# EAGLE design clock (EAGLE 7.6.0)
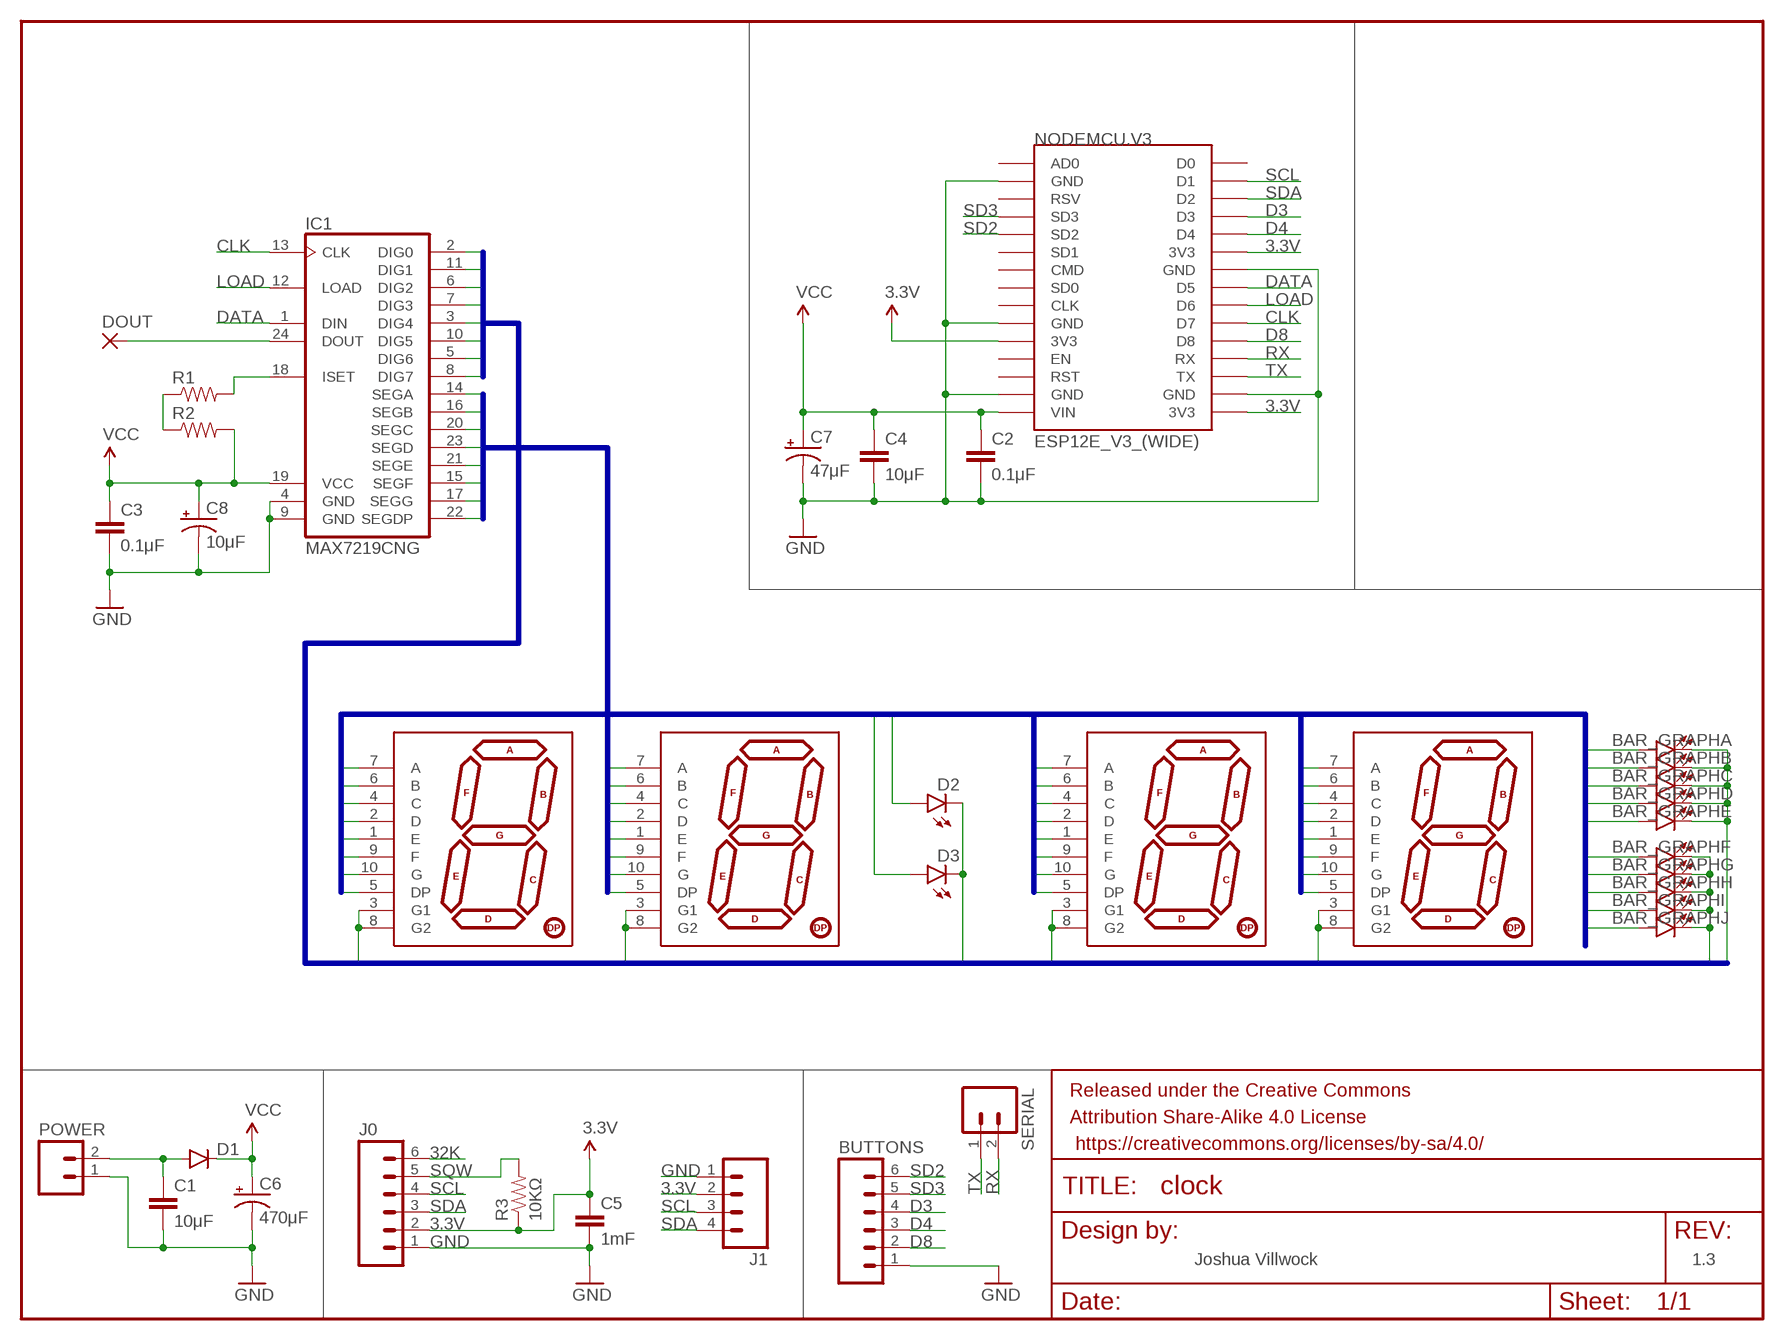
[diagram p0: schematic, sheet 1]

## Parts
BAR_GRAPH  LED_BARGRAPH_10  [LED_BARGAPH_10]
BUTTONS  M06POLAR  [MOLEX-1X6]
C1  10μF  CAP1206  [1206]
C2  0.1μF  CAP1206  [1206]
C3  0.1μF  CAP1206  [1206]
C4  10μF  CAP1206  [1206]
C5  1mF  CAP1206  [1206]
C6  470μF  CAP_POLPTH1  [CPOL-RADIAL-100UF-25V]
C7  47μF  CAP_POLPTH1  [CPOL-RADIAL-100UF-25V]
C8  10μF  CAP_POLPTH1  [CPOL-RADIAL-100UF-25V]
D1  DIODE1N4148  [DIODE-1N4148]
D2  LED3MM  [LED3MM]
D3  LED3MM  [LED3MM]
DIG_0  7-SEGMENT-DISPLAY-REAL-1"  [7-SEGMENT-REAL-1"]
DIG_1  7-SEGMENT-DISPLAY-REAL-1"  [7-SEGMENT-REAL-1"]
DIG_2  7-SEGMENT-DISPLAY-REAL-1"  [7-SEGMENT-REAL-1"]
DIG_3  7-SEGMENT-DISPLAY-REAL-1"  [7-SEGMENT-REAL-1"]
DOUT  1,6/0,9  [1,6/0,9]
FRAME1  FRAME-LETTER  [CREATIVE_COMMONS]
IC1  MAX7219CNG  [DIL24-3]
J0  M06POLAR  [MOLEX-1X6]
J1  M04POLAR  [MOLEX-1X4]
NODEMCU.V3  ESP12E_V3_(WIDE)  [ESP12E_V3_WIDE]
POWER  M02POLAR_LOCK  [MOLEX-1X2_LOCK]
R1  RESISTOR1206  [1206]
R2  RESISTOR1206  [1206]
R3  10KΩ  RESISTOR1206  [1206]
SERIAL  M02PTH  [1X02]

## Nets
3.3V: C5.1 J0.2 J1.2 NODEMCU.V3.3V3@0(3V3) NODEMCU.V3.3V3@1(3V3) NODEMCU.V3.3V3@2(3V3) R3.1
32K: J0.6
A: BAR_GRAPH.4(D:A) BAR_GRAPH.9(I:A) DIG_0.7(A) DIG_1.7(A) DIG_2.7(A) DIG_3.7(A) IC1.14(SEGA)
B: BAR_GRAPH.3(C:A) BAR_GRAPH.8(H:A) DIG_0.6(B) DIG_1.6(B) DIG_2.6(B) DIG_3.6(B) IC1.16(SEGB)
C: BAR_GRAPH.2(B:A) BAR_GRAPH.7(G:A) DIG_0.4(C) DIG_1.4(C) DIG_2.4(C) DIG_3.4(C) IC1.20(SEGC)
CLK: IC1.13(CLK) NODEMCU.V3.D7
D: BAR_GRAPH.1(A:A) BAR_GRAPH.6(F:A) D3.A DIG_0.2(D) DIG_1.2(D) DIG_2.2(D) DIG_3.2(D) IC1.23(SEGD)
D3: BUTTONS.4 NODEMCU.V3.D3
D4: BUTTONS.3 NODEMCU.V3.D4
D8: BUTTONS.2 NODEMCU.V3.D8
DATA: IC1.1(DIN) NODEMCU.V3.D5
DIGIT0: DIG_1.3(G1) DIG_1.8(G2) IC1.2(DIG0)
DIGIT1: DIG_2.3(G1) DIG_2.8(G2) IC1.11(DIG1)
DIGIT2: IC1.6(DIG2)
DIGIT3: BAR_GRAPH.16(E:C) BAR_GRAPH.17(D:C) BAR_GRAPH.18(C:C) BAR_GRAPH.19(B:C) BAR_GRAPH.20(A:C) IC1.7(DIG3)
DIGIT4: D2.K(C) D3.K(C) IC1.3(DIG4)
DIGIT5: DIG_3.3(G1) DIG_3.8(G2) IC1.10(DIG5)
DIGIT6: DIG_0.3(G1) DIG_0.8(G2) IC1.5(DIG6)
DIGIT7: BAR_GRAPH.11(J:C) BAR_GRAPH.12(I:C) BAR_GRAPH.13(H:C) BAR_GRAPH.14(G:C) BAR_GRAPH.15(F:C) IC1.8(DIG7)
DOUT: DOUT.1(P) IC1.24(DOUT)
DP: BAR_GRAPH.5(E:A) BAR_GRAPH.10(J:A) DIG_0.5(DP) DIG_1.5(DP) DIG_2.5(DP) DIG_3.5(DP) IC1.22(SEGDP)
E: DIG_0.1(E) DIG_1.1(E) DIG_2.1(E) DIG_3.1(E) IC1.21(SEGE)
F: D2.A DIG_0.9(F) DIG_1.9(F) DIG_2.9(F) DIG_3.9(F) IC1.15(SEGF)
G: DIG_0.10(G) DIG_1.10(G) DIG_2.10(G) DIG_3.10(G) IC1.17(SEGG)
GND: BUTTONS.1 C1.2 C2.2 C3.2 C4.2 C5.2 C6.2(-) C7.2(-) C8.2(-) IC1.4(GND) IC1.9(GND) J0.1 J1.1 NODEMCU.V3.GND@0(GND) NODEMCU.V3.GND@1(GND) NODEMCU.V3.GND@2(GND) NODEMCU.V3.GND@3(GND) NODEMCU.V3.GND@5(GND) POWER.1
ISET: IC1.18(ISET) R1.2
LOAD: IC1.12(LOAD) NODEMCU.V3.D6
N$4: R1.1 R2.1
RX: NODEMCU.V3.RX SERIAL.2
SCL: J0.4 J1.3 NODEMCU.V3.D1
SD2: BUTTONS.6 NODEMCU.V3.SD2
SD3: BUTTONS.5 NODEMCU.V3.SD3
SDA: J0.3 J1.4 NODEMCU.V3.D2
SQW: J0.5 R3.2
TX: NODEMCU.V3.TX SERIAL.1
VCC: C2.1 C3.1 C4.1 C6.1(+) C7.1(+) C8.1(+) D1.C IC1.19(VCC) NODEMCU.V3.VIN R2.2
VIN: C1.1 D1.A POWER.2
Unconnected: NODEMCU.V3.AD0 NODEMCU.V3.CLK NODEMCU.V3.CMD NODEMCU.V3.D0 NODEMCU.V3.EN NODEMCU.V3.RST NODEMCU.V3.RSV@1(RSV) NODEMCU.V3.SD0 NODEMCU.V3.SD1

## Buses
DIGIT[0..7]
SEG:A,B,C,D,E,F,G,DP

## Notes on the sheet
- Joshua Villwock | 1.3

## Library data of the parts
BAR_GRAPH = SparkFun-LED:LED_BARGRAPH_10: 10-Segment LED Bar Graph SFE part numbers: COM-09935 (red, Vf = 2.1V, Ifmax = 20mA) COM-09936 (yellow, Vf = 2.1V, Ifmax = 20mA) COM-09937 (blue, Vf = 3.4V, Ifmax = 20mA) COM-09938 (green, Vf = 3.4V, Ifmax = 20mA)
BUTTONS J0 = SparkFun-Connectors:M06: Header 6 Standard 6-pin 0.1" header. Use with straight break away headers (SKU : PRT-00116), right angle break away headers (PRT-00553), swiss pins (PRT-00743), machine pins (PRT-00117), and female headers (PRT-00115). Molex polarized connector foot print use with SKU : PRT-08094 with associated crimp pins and housings. NOTES ON THE VARIANTS LOCK and LOCK_LONGPADS... This footprint was designed to help hold the alignment of a through-hole component (i.e. 6-pin header) while soldering it into place. You may notice that each hole has been shifted either up or down by 0.005 of an inch from it's more standard position (which is a perfectly straight line). This slight alteration caused the pins (the squares in the middle) to touch the edges of the holes. Because they are alternating, it causes a "brace" to hold the component in place. 0.005 has proven to be the perfect amount of "off-center" position when using our standard breakaway headers. Although looks a little odd when you look at the bare footprint, once you have a header in there, the alteration is very hard to notice. Also,if you push a header all the way into place, it is covered up entirely on the bottom side. This idea of altering the position of holes to aid alignment will be further integrated into the Sparkfun Library for other footprints. It can help hold any component with 3 or more connection pins.
C1-C5 = SparkFun-Capacitors:CAP: Capacitor Standard 0603 ceramic capacitor, and 0.1" leaded capacitor.
C6-C8 = SparkFun-Capacitors:CAP_POL: Capacitor Polarized These are standard SMD and PTH capacitors. Normally 10uF, 47uF, and 100uF in electrolytic and tantalum varieties. Always verify the external diameter of the through hole cap, it varies with capacity, voltage, and manufacturer. The EIA devices should be standard.
D1 = SparkFun-DiscreteSemi:DIODE: Diode These are standard reverse protection diodes and small signal diodes. SMA package can handle up to about 1A. SOD-323 can handle about 200mA. What the SOD-323 package when ordering, there are some mfgs out there that are 5-pin packages.; PROD_ID: DIO-08378; VALUE: 1N4148
D2 D3 = SparkFun-LED:LED: LEDs Standard schematic elements and footprints for 5mm, 3mm, 1206, and 0603 sized LEDs. 5mm - Spark Fun Electronics SKU : COM-00529 (and others); PROD_ID: DIO-08794
DIG_0 DIG_1-DIG_3 = custom_display:7-SEGMENT-DISPLAY-REAL-1": 7-Segment Display 1" Red (COM-08546) EZ is for kits. Pads are only exposed on the bottom side to help prevent soldering in upside down.
DOUT = wirepad:1,6/0,9: THROUGH-HOLE PAD
FRAME1 = SparkFun-Aesthetics:FRAME-LETTER: Schematic Frame Standard 8.5x11 US Letter frame
IC1 = max7219:MAX7219CNG: LED DISPLAY DRIVER; MF: MAXIM; MPN: MAX7219CNG; OC_FARNELL: 1523914; OC_NEWARK: 34C4018
J1 = SparkFun-Connectors:M04: Header 4 Standard 4-pin 0.1" header. Use with straight break away headers (SKU : PRT-00116), right angle break away headers (PRT-00553), swiss pins (PRT-00743), machine pins (PRT-00117), and female headers (PRT-00115). Molex polarized connector foot print use with SKU : PRT-08231 with associated crimp pins and housings. 1MM SMD Version SKU: PRT-10208
NODEMCU.V3 = NODEMCUv1:ESP12E_V3_(WIDE): ESP12E DEVKIT BOARD
POWER SERIAL = SparkFun-Connectors:M02: Standard 2-pin 0.1" header. Use with - straight break away headers ( PRT-00116) - right angle break away headers (PRT-00553) - swiss pins (PRT-00743) - machine pins (PRT-00117) - female headers (PRT-00115) Molex polarized connector foot print use with: PRT-08233 with associated crimp pins and housings. 2.54_SCREWTERM for use with PRT-10571. 3.5mm Screw Terminal footprints for PRT-08084 5mm Screw Terminal footprints for use with PRT-08432
R1-R3 = SparkFun-Resistors:RESISTOR: Resistor Basic schematic elements and footprints for 0603, 1206, and PTH resistors.

## Board
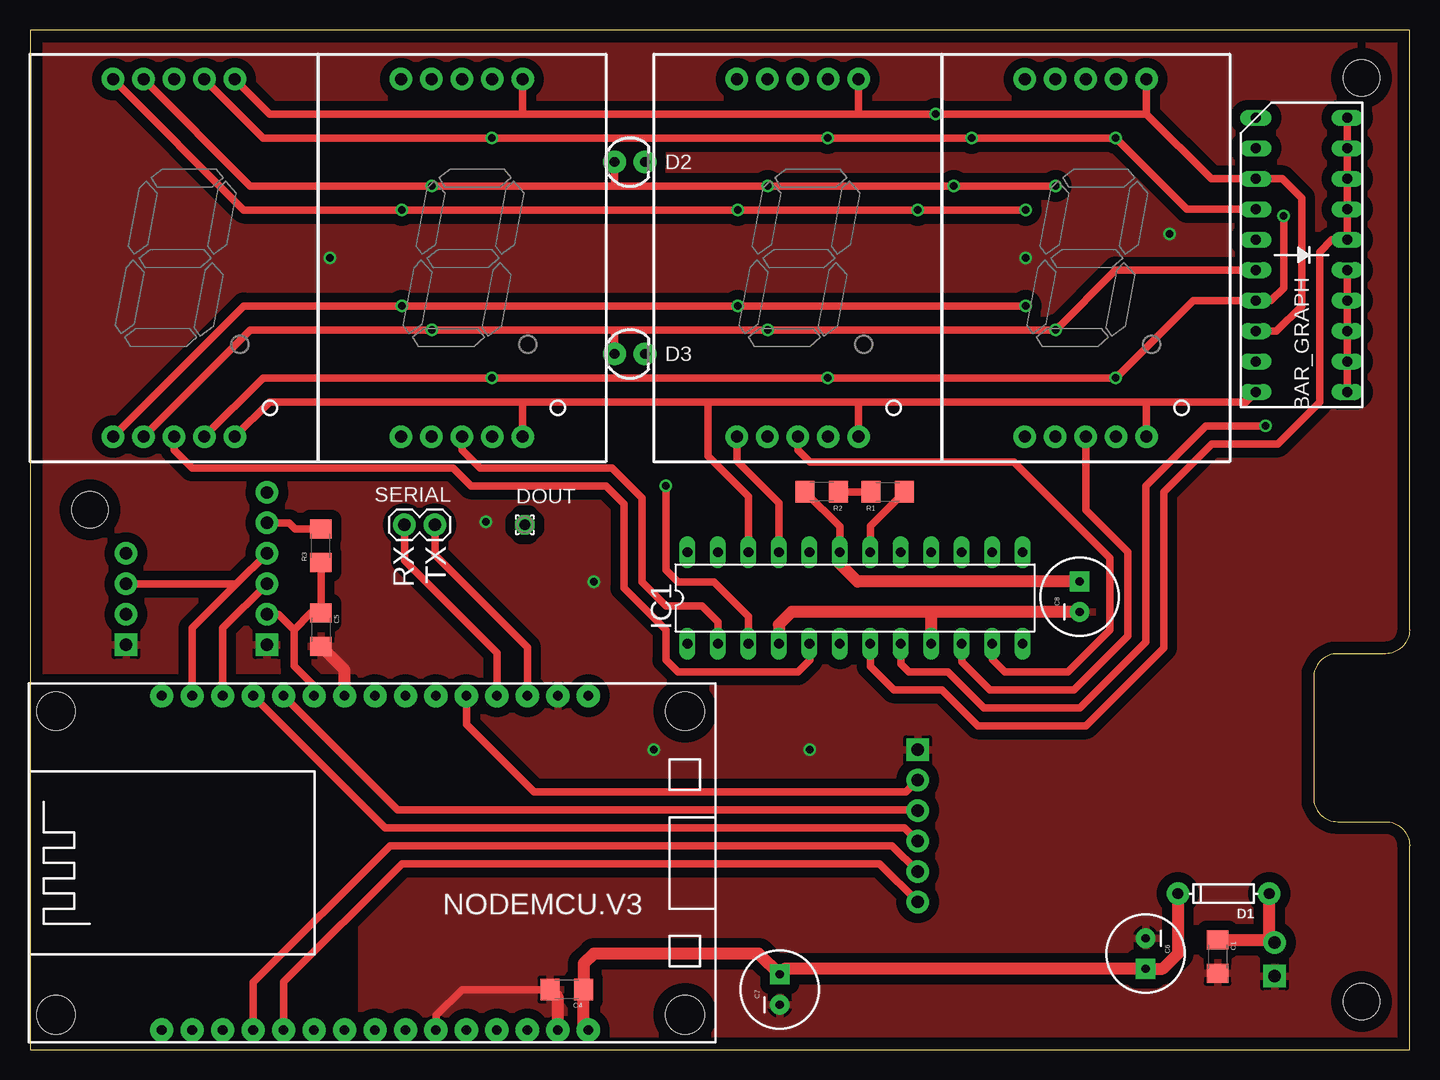
[diagram p1: board, top side]
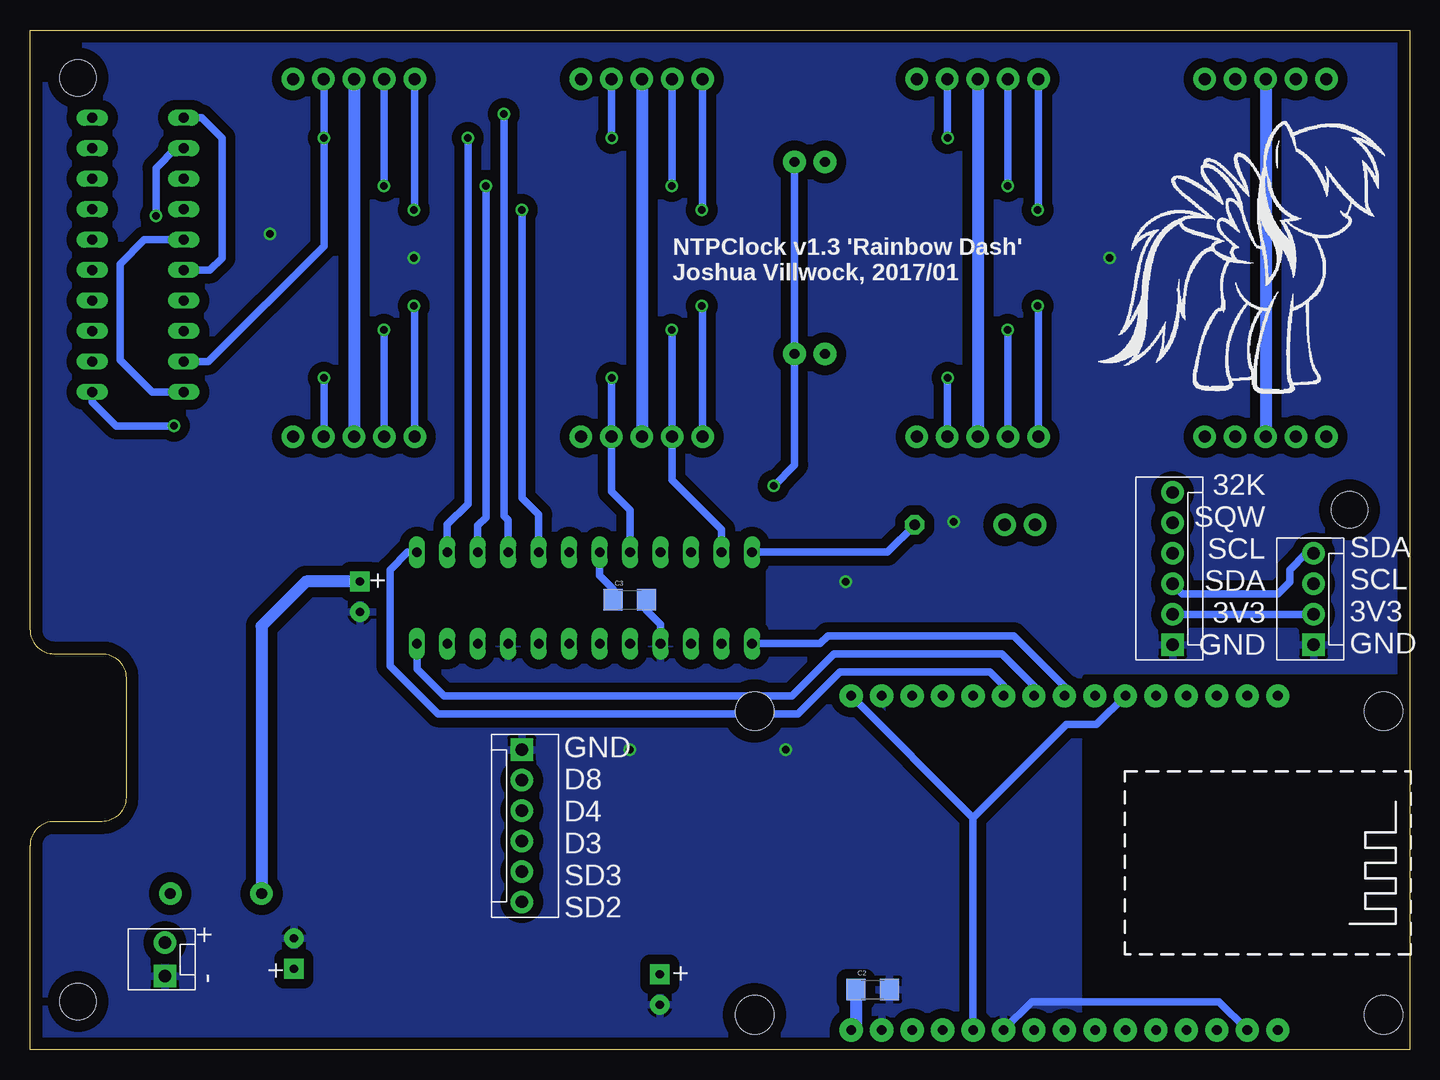
[diagram p2: board, bottom side, seen from below]

Size 115 x 85 mm. Coordinates in mm from the lower left corner, seen from the top.
Outline: 0,0 115,0 115,17 arc90 113,19 109,19 arc-90 107,21 107,31 arc-90 109,33 113,33 arc90 115,35 115,85 0,85 0,0
Copper layers (1*16): Top 0.035mm / dielectric 1.5mm / Bottom 0.035mm
Design rules "Joshua_Smart": minimum track width 7mil, minimum drill 16mil, track to track 7mil, track to pad 7mil, pad to pad 7mil, via to via 7mil, smd to smd 7mil, copper to edge 40mil, drill to drill 8mil, minimum pad ring 10mil, minimum via ring 8mil, stop-mask expansion 4mil, vias tented up to drill 0mil, thermal gap 10mil
Holes 3 mm at 111,81 111,4 5,45

### Footprints (pad centres in the part's own frame; a part is rotated, then mirrored left to right if it is on the bottom)
LED_BARGAPH_10 = drill 0.813 long: 1 -11.43,-3.81; 2 -8.89,-3.81; 3 -6.35,-3.81; 4 -3.81,-3.81; 5 -1.27,-3.81; 6 1.27,-3.81; 7 3.81,-3.81; 8 6.35,-3.81; 9 8.89,-3.81; 10 11.43,-3.81; 11 11.43,3.81; 12 8.89,3.81; 13 6.35,3.81; 14 3.81,3.81; 15 1.27,3.81; 16 -1.27,3.81; 17 -3.81,3.81; 18 -6.35,3.81; 19 -8.89,3.81; 20 -11.43,3.81
MOLEX-1X6 = drill 1.016 pad 1.88 square: 1 0,0 | drill 1.016 pad 1.88: 2 2.54,0; 3 5.08,0; 4 7.62,0; 5 10.16,0; 6 12.7,0
1206 = smd 1.6 x 1.8: 1 -1.4,0; 2 1.4,0
CPOL-RADIAL-100UF-25V = drill 0.7 pad 1.651 square: 1 1.27,0 | drill 0.7 pad 1.651: 2 -1.27,0
DIODE-1N4148 = drill 0.9 pad 1.88: A -3.81,0; C 3.81,0
LED3MM = drill 0.813 pad 1.88: A -1.27,0; K 1.27,0
7-SEGMENT-REAL-1" = drill 1 pad 1.88: 1 -2.08,-10.91; 2 0.46,-10.91; 3 3,-10.91; 4 5.54,-10.91; 5 8.08,-10.91; 6 8.08,18.91; 7 5.54,18.91; 8 3,18.91; 9 0.46,18.91; 10 -2.08,18.91
1,6/0,9 = drill 0.914 pad 1.6 octagon: 1 0,0
DIL24-3 = drill 0.813 long: 1 -13.97,-3.81; 2 -11.43,-3.81; 3 -8.89,-3.81; 4 -6.35,-3.81; 5 -3.81,-3.81; 6 -1.27,-3.81; 7 1.27,-3.81; 8 3.81,-3.81; 9 6.35,-3.81; 10 8.89,-3.81; 11 11.43,-3.81; 12 13.97,-3.81; 13 13.97,3.81; 14 11.43,3.81; 15 8.89,3.81; 16 6.35,3.81; 17 3.81,3.81; 18 1.27,3.81; 19 -1.27,3.81; 20 -3.81,3.81; 21 -6.35,3.81; 22 -8.89,3.81; 23 -11.43,3.81; 24 -13.97,3.81
MOLEX-1X4 = drill 1.016 pad 1.88 square: 1 0,0 | drill 1.016 pad 1.88: 2 2.54,0; 3 5.08,0; 4 7.62,0
ESP12E_V3_WIDE = drill 0.8 pad 1.93: 3V3@0 -13.93,-6.37; 3V3@1 13.93,6.33; 3V3@2 13.93,-16.53; AD0 -13.93,19.03; CLK -13.93,-1.29; CMD -13.93,3.79; D0 13.93,19.03; D1 13.93,16.49; D2 13.93,13.95; D3 13.93,11.41; D4 13.93,8.87; D5 13.93,1.25; D6 13.93,-1.29; D7 13.93,-3.83; D8 13.93,-6.37; EN -13.93,-8.91; GND@0 -13.93,-3.83; GND@1 -13.93,-13.99; GND@2 13.93,3.79; GND@3 13.93,-13.99; GND@5 -13.93,16.49; RST -13.93,-11.45; RSV@1 -13.93,13.95; RX 13.93,-8.91; SD0 -13.93,1.25; SD1 -13.93,6.33; SD2 -13.93,8.87; SD3 -13.93,11.41; TX 13.93,-11.45; VIN -13.93,-16.53 | hole 3.2: -12.66,27.84; 12.66,27.84; 12.66,-24.59; -12.66,-24.59
MOLEX-1X2_LOCK = drill 1.016 pad 1.88 square: 1 -0.127,0 | drill 1.016 pad 1.88: 2 2.667,0
1X02 = drill 1.016 pad 1.88: 1 0,0; 2 2.54,0

### Placement (x,y rotation side)
BAR_GRAPH  106,66.25 270 top
BUTTONS  74,25 270 bottom
C1  99,7.75 270 top
C2  44.75,5 0 bottom
C3  65,37.5 0 bottom
C4  44.75,5 180 top
C5  24.25,35 270 top
C6  93,8 270 top
C7  62.5,5 90 top
C8  87.5,37.75 90 top
D1  99.5,13 180 top
D2  50,74 0 top
D3  50,58 0 top
DIG_0  9,62 0 top
DIG_1  33,62 0 top
DIG_2  61,62 0 top
DIG_3  85,62 0 top
DOUT  41.25,43.75 0 top
FRAME1  24,-8 0 top  (outside the outline)
IC1  68.78,37.65 0 top
J0  19.75,33.75 90 bottom
J1  8,33.75 90 bottom
NODEMCU.V3  30.01,15.56 90 top
POWER  103.75,6.25 90 bottom
R1  71.5,46.5 0 top
R2  66,46.5 180 top
R3  24.25,42 90 top
SERIAL  33.75,43.75 180 top

### Tracks (layer width: path | path; a pad name or v marks a point on that pad's centre or on a via)
3.3V
  Top 0.61: NODEMCU.V3.3V3@1 23.68,30.32 22,32 22,35 | 22,35 20.71,36.29 J0.2 | 22,35 23.4,36.4 C5.1 R3.1
  Bottom 0.61: NODEMCU.V3.3V3@0 36.38,19.33 | 36.38,19.33 NODEMCU.V3.3V3@2 | NODEMCU.V3.3V3@1 26.09,27.09 28.62,27.09 36.38,19.33 | J1.2 J0.2
A  (via drill 0.6, 0.6 pad 0.8)
  Top 0.61: BAR_GRAPH.4 96.44,70.06 v90.5,76 v78.5,76 v66.5,76 v38.5,76 19.45,76 DIG_0.7
  Bottom 0.61: DIG_2.7 66.54,76 v66.5,76 | DIG_1.7 38.54,76 v38.5,76 | IC1.14 80.21,43.79 78.5,45.5 v78.5,76 | DIG_3.7 90.5,80.87 v90.5,76 90.5,67 100.14,57.36 BAR_GRAPH.9
B  (via drill 0.6)
  Top 0.61: 41.08,78 69.08,78 | 69.08,78 v75.5,78 93.08,78 | DIG_1.6 41.08,78 | DIG_2.6 69.08,78 | DIG_3.6 93.08,78 | 93.08,78 98.48,72.6 BAR_GRAPH.3 104.4,72.6 106,71 106,62 103.9,59.9 BAR_GRAPH.8 | DIG_0.6 19.99,78 41.08,78
  Bottom 0.61: IC1.16 75.13,44.13 75.5,44.5 v75.5,78
C  (via drill 0.6, 0.6 pad 0.8)
  Top 0.61: v104.5,69.5 104.5,63.5 103.44,62.44 BAR_GRAPH.7 96.98,62.44 90.54,56 v90.5,56 v66.5,56 v38.5,56 19.45,56 DIG_0.4
  Bottom 0.61: DIG_1.4 38.54,56 v38.5,56 | v66.5,56 66.54,56 DIG_2.4 66.54,46.54 64.97,44.97 IC1.20 | DIG_3.4 90.5,51.09 v90.5,56 90.54,56 | BAR_GRAPH.2 102.86,75.14 104.5,73.5 v104.5,69.5
CLK
  Bottom 0.61: IC1.13 83.54,41.46 85,40 85,32 81,28 51,28 47.5,31.5 35,31.5 33.84,30.34 NODEMCU.V3.D7
D  (via drill 0.6 pad 0.8)
  Top 0.61: 48.73,60 v33.5,60 18.37,60 DIG_0.2 | 48.73,60 v61.5,60 v85.5,60 90.48,64.98 BAR_GRAPH.6 | D3.A 48.73,60
  Bottom 0.61: DIG_1.2 33.46,60 v33.5,60 | v61.5,60 61.46,60 DIG_2.2 61.46,47.46 57.35,43.35 IC1.23 | DIG_3.2 85.46,60 v85.5,60 | BAR_GRAPH.1 100.68,77.68 99,76 99,66 100.02,64.98 BAR_GRAPH.6
D3
  Top 0.61: NODEMCU.V3.D3 29.59,18.5 72.88,18.5 BUTTONS.4
D4
  Top 0.61: NODEMCU.V3.D4 30.63,20 73.92,20 BUTTONS.3
D8
  Top 0.61: NODEMCU.V3.D8 36.38,27.12 42,21.5 73.04,21.5 BUTTONS.2
DATA
  Bottom 0.61: NODEMCU.V3.D5 28.76,30.26 33,34.5 48.5,34.5 49.16,33.84 IC1.1
DIGIT0
  Top 0.61: DIG_1.3 36,50 37.5,48.5 48.5,48.5 51,46 51,39 53,37 56,37 57.35,35.65 IC1.2
  Bottom 1.016: DIG_1.8 DIG_1.3
DIGIT1
  Top 0.61: IC1.11 80.21,32.54 81.25,31.5 86.5,31.5 90,35 90,41 82,49 65,49 64,50 DIG_2.3
  Bottom 1.016: DIG_2.8 DIG_2.3
DIGIT3
  Top 0.61: BAR_GRAPH.20 BAR_GRAPH.19 BAR_GRAPH.18 BAR_GRAPH.17 BAR_GRAPH.16 108.52,67.52 107.5,66.5 107.5,54 104,50.5 98.5,50.5 94.5,46.5 94.5,33.5 88,27 79,27 76,30 72,30 70.05,31.95 IC1.7
DIGIT4  (via drill 0.6 pad 0.8)
  Top 0.61: IC1.3 59.89,36.11 57,39 54,39 53,40 v53,47
  Bottom 0.61: D2.K D3.K 51.27,48.73 v53,47
DIGIT5
  Top 0.61: IC1.10 77.67,32.33 80,30 87,30 91.5,34.5 91.5,41.5 88,45 DIG_3.3
  Bottom 1.016: DIG_3.8 DIG_3.3
DIGIT6
  Top 0.61: DIG_0.3 12,50 13.5,48.5 35.25,48.5 36.75,47 48,47 49.5,45.5 49.5,38.5 53,35 53,32.5 54,31.5 64,31.5 65,32.5 65,33.81 IC1.5
  Bottom 1.016: DIG_0.8 DIG_0.3
DIGIT7  (via drill 0.6 pad 0.81)
  Top 0.61: BAR_GRAPH.15 BAR_GRAPH.14 BAR_GRAPH.13 BAR_GRAPH.12 BAR_GRAPH.11 | IC1.8 72.59,32.16 73.25,31.5 76.5,31.5 79.5,28.5 87.5,28.5 93,34 93,47 98,52 v103,52
  Bottom 0.61: BAR_GRAPH.11 109.81,54 107.81,52 v103,52
DOUT
  Bottom 0.61: IC1.24 43.54,41.46 DOUT.1
DP
  Top 0.61: 41.08,54 56.5,54 | 56.5,54 69.08,54 | 69.08,54 93.08,54 | DIG_1.5 41.08,54 | DIG_2.5 69.08,54 | DIG_3.5 93.08,54 | IC1.22 59.89,46.11 56.5,49.5 56.5,54 | 93.08,54 101.37,54 BAR_GRAPH.10 | DIG_0.5 19.99,54 41.08,54
  Bottom 0.61: BAR_GRAPH.10 104.82,54.82 107.5,57.5 107.5,65.5 105.48,67.52 BAR_GRAPH.5
E  (via drill 0.6 pad 0.8)
  Top 0.61: v83,62 v59,62 v31,62 17.83,62 DIG_0.1 | IC1.21 62.43,45.57 58.92,49.08 DIG_2.1
  Bottom 0.61: DIG_1.1 30.92,62 v31,62 | DIG_2.1 58.92,62 v59,62 | DIG_3.1 82.92,62 v83,62
F  (via drill 0.6, 0.6 pad 0.8)
  Top 0.61: 48.73,72 v33.5,72 18.37,72 DIG_0.9 | 48.73,72 v61.5,72 v77,72 v85.5,72 | D2.A 48.73,72
  Bottom 0.61: DIG_3.9 85.46,72 v85.5,72 | DIG_2.9 61.46,72 v61.5,72 | DIG_1.9 33.46,72 v33.5,72 | IC1.15 77.67,43.67 77,44.34 v77,72
G  (via drill 0.6 pad 0.8)
  Top 0.61: v83,70 v74,70 v59,70 v31,70 17.83,70 DIG_0.10
  Bottom 0.61: DIG_3.10 82.92,70 v83,70 | DIG_2.10 58.92,70 v59,70 | DIG_1.10 30.92,70 v31,70 | IC1.17 72.59,44.59 74,46 v74,70
GND  (via drill 0.6)
  Top 0.61: NODEMCU.V3.GND@0 33.84,2.84 36,5 C4.2
  Top 1.016: C8.2 75.13,36.48 | 75.13,36.48 63.48,36.48 62.43,35.43 IC1.4 | IC1.9 75.13,36.48 | NODEMCU.V3.GND@1 44,4.35 C4.2 | NODEMCU.V3.GND@2 26.22,31.63 C5.2
  Bottom 0.61: C3.2 63.6,36.6 62.43,35.43 IC1.4 | NODEMCU.V3.GND@5 15.89,4 31.47,4 NODEMCU.V3.GND@0
  other vias: 38,44 47,39 52,25 65,25 83,66 95,68 25,66
  pour Top (isolate 0.813): -1,-1 116,-1 116,86 -1,86
  pour Bottom (isolate 0.813): -2,-2 117,-2 117,87 -2,87
ISET
  Top 0.61: IC1.18 70.05,43.65 R1.2
LOAD
  Bottom 0.61: IC1.12 82.75,31.75 80.5,29.5 51.5,29.5 48,33 34,33 31.3,30.3 NODEMCU.V3.D6
N$3
  cutout Top: 54,41 54,34 88,32 88,41
N$4
  Top 0.61: R2.1 R1.1
N$5
  cutout Bottom: 54,41 54,34 84,34 84,41
N$6
  cutout Bottom: 0,31 27,31 27,0 0,0
N$7
  cutout Top: 0,31 27,31 27,0 0,0
RX
  Top 0.61: NODEMCU.V3.RX 38.92,33.08 31.21,40.79 SERIAL.2
SCL
  Top 0.61: NODEMCU.V3.D1 13.52,35.14 17.19,38.81 | 17.19,38.81 J0.4 | J1.3 17.17,38.83 17.19,38.81
SD2
  Top 0.61: NODEMCU.V3.SD2 21.14,5.64 31,15.5 70.8,15.5 BUTTONS.6
SD3
  Top 0.61: NODEMCU.V3.SD3 18.6,5.6 30,17 71.84,17 BUTTONS.5
SDA
  Top 0.61: NODEMCU.V3.D2 16.06,35.14 J0.3
  Bottom 0.61: J1.4 8.63,41.37 10,40 10,39 11,38 18.92,38 J0.3
SQW
  Top 0.61: J0.5 21.59,43.91 22.1,43.4 R3.2
TX
  Top 0.61: NODEMCU.V3.TX 41.46,33.54 33.75,41.25 SERIAL.1
VCC
  Top 0.61: IC1.19 67.51,43.59 R2.2
  Top 1: 60.77,8 C7.1 62.96,6.73 C6.1 94.42,6.73 95.69,8 D1.C
  Top 1.016: C8.1 68.98,39.02 67.51,40.49 IC1.19 | 60.77,8 47,8 46.15,7.15 C2.1 46.15,2.02 NODEMCU.V3.VIN
  Bottom 0.61: C3.1 66.4,38.4 67.51,39.51 IC1.19
  Bottom 1: C8.1 91.98,39.02 95.69,35.31 D1.C
  Bottom 1.016: C2.1 46.15,2.02 NODEMCU.V3.VIN
VIN
  Top 1: D1.A 103.31,9.14 POWER.2 103.3,9.15 C1.1

### Text on the board
tPlace: RX / TX
bPlace: NTPClock v1.3 'Rainbow Dash' / Joshua Villwock, 2017/01 | 32K / SQW / SCL / SDA / 3V3 / GND | + | SDA / SCL / 3V3 / GND | GND / D8 / D4 / D3 / SD3 / SD2 | + | + | + | -
Document: Joshua villwock